# Altium schematic sheet DCDC_RPI.SchDoc
size 420 x 297 mm; SheetNumber: 4; SheetTotal: 4
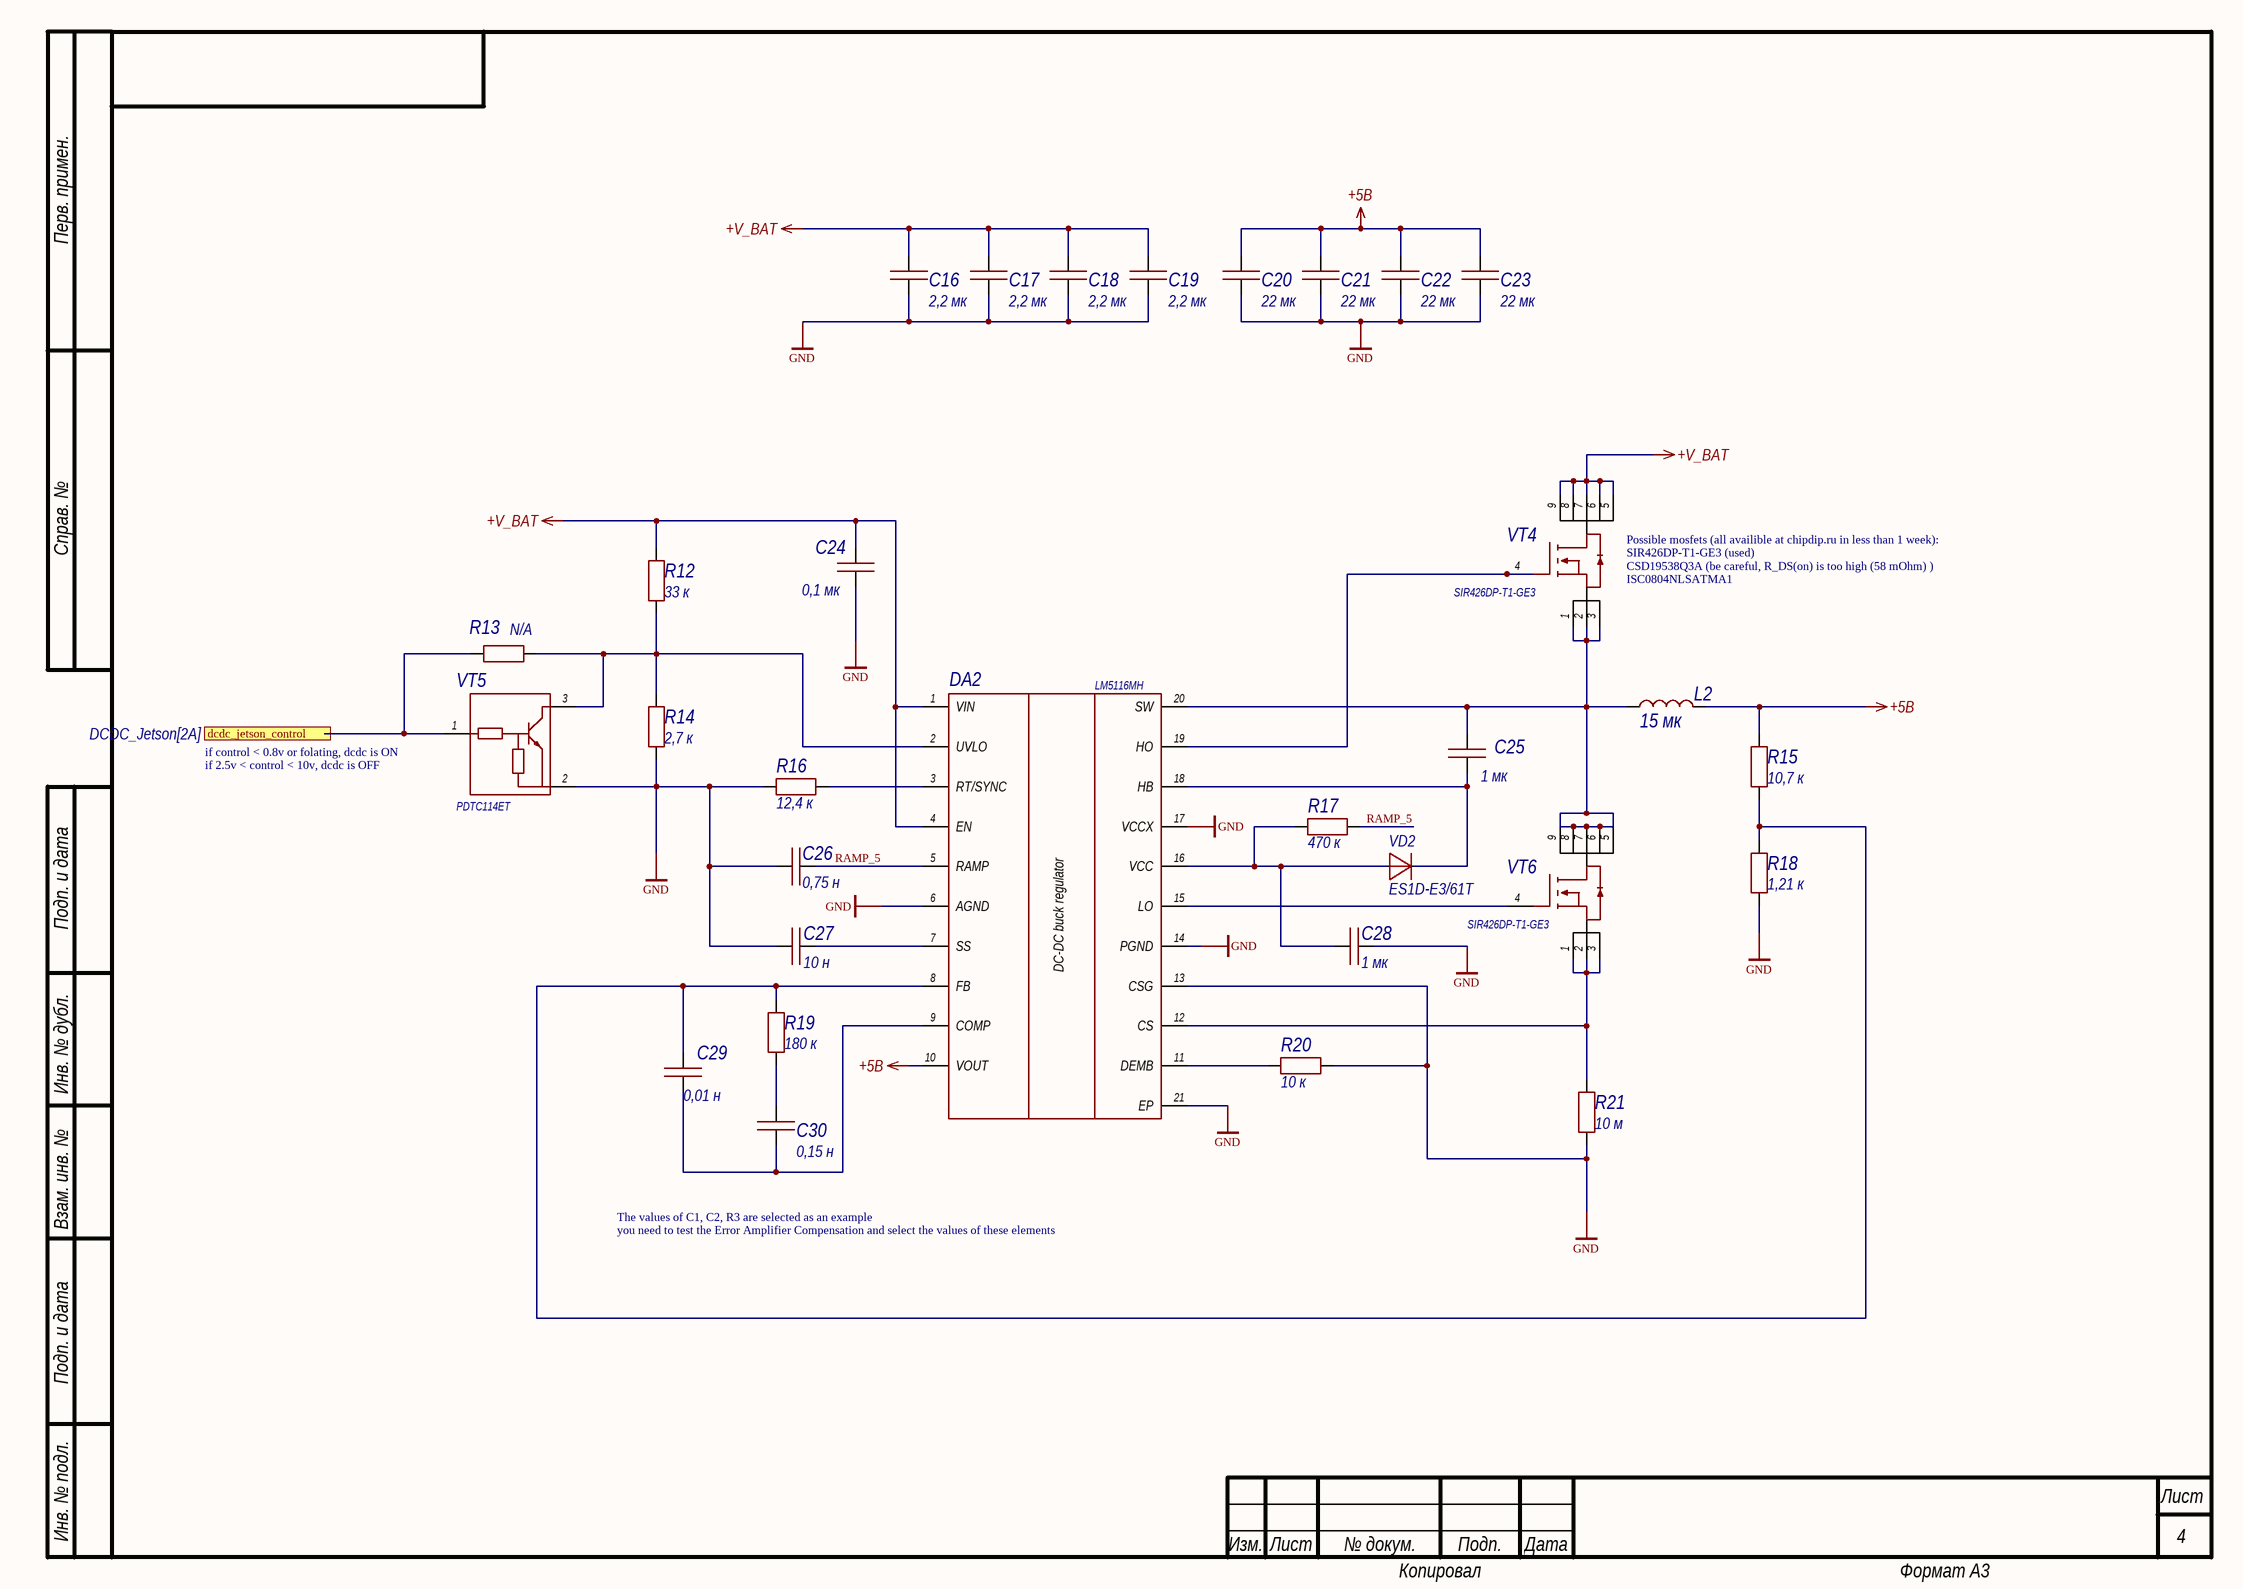
[diagram p0: DCDC_RPI.SchDoc]

## Parts
C16  value 2,2 мк  [1206C]  (hidden comment: Capacitor)
C17  value 2,2 мк  [1206C]  (hidden comment: Capacitor)
C18  value 2,2 мк  [1206C]  (hidden comment: Capacitor)
C19  value 2,2 мк  [1206C]  (hidden comment: Capacitor)
C20  value 22 мк  [1210C]  (hidden comment: Capacitor)
C21  value 22 мк  [1210C]  (hidden comment: Capacitor)
C22  value 22 мк  [1210C]  (hidden comment: Capacitor)
C23  value 22 мк  [1210C]  (hidden comment: Capacitor)
C24  value 0,1 мк  [0603C]  (hidden comment: Capacitor)
C25  value 1 мк  [0603C]  (hidden comment: Capacitor)
C26  value 0,75 н  [0603C]  (hidden comment: Capacitor)
C27  value 10 н  [0603C]  (hidden comment: Capacitor)
C28  value 1 мк  [0603C]  (hidden comment: Capacitor)
C29  value 0,01 н  [0603C]  (hidden comment: Capacitor)
C30  value 0,15 н  [0603C]  (hidden comment: Capacitor)
DA2  LM5116MH  [HTSSOP-20]
L2  value 15 мк  [SPRH127]  (hidden comment: CDSPRH127-150M)
R12  value 33 к  [0603R]  (hidden comment: Resistor)
R13  Resistor  [0603R]  (value not drawn)
R14  value 2,7 к  [0603R]  (hidden comment: Resistor)
R15  value 10,7 к  [0603R]  (hidden comment: Resistor)
R16  value 12,4 к  [0603R]  (hidden comment: Resistor)
R17  value 470 к  [0603R]  (hidden comment: Resistor)
R18  value 1,21 к  [0603R]  (hidden comment: Resistor)
R19  value 180 к  [0603R]  (hidden comment: Resistor)
R20  value 10 к  [0603R]  (hidden comment: Resistor)
R21  value 10 м  [1210R]  (hidden comment: Resistor)
VD2  ES1D-E3/61T  [SMA]
VT4  SIR426DP-T1-GE3  [PowerPAK_SO-8]
VT5  PDTC114ET  [SOT23-3]
VT6  SIR426DP-T1-GE3  [PowerPAK_SO-8]

## Ports
dcdc_jetson_control (in, see DCDC_Jetson[2A])

## Nets
+5В: C20.2 C21.2 C22.2 C23.2 DA2.10(VOUT) L2.2 R15.2
+V_BAT: C16.2 C17.2 C18.2 C19.2 C24.2 DA2.1(VIN) DA2.4(EN) R12.2 VT4.5 VT4.6 VT4.7 VT4.8 VT4.9
GND: C16.1 C17.1 C18.1 C19.1 C20.1 C21.1 C22.1 C23.1 C24.1 C26.1 C27.1 C28.2 DA2.6(AGND) DA2.13(CSG) DA2.14(PGND) DA2.17(VCCX) DA2.21(EP) R14.1 R16.1 R18.1 R20.2 R21.1 VT5.2(E)
dcdc_jetson_control: R13.1 VT5.1(B) ; port dcdc_jetson_control
RAMP_5: C26.2 DA2.5(RAMP) R17.2
NetC25_1: C25.1 DA2.18(HB) VD2.2
NetC25_2: C25.2 DA2.20(SW) L2.1 VT4.1 VT4.2 VT4.3 VT6.5 VT6.6 VT6.7 VT6.8 VT6.9
NetC27_2: C27.2 DA2.7(SS)
NetC28_1: C28.1 DA2.16(VCC) R17.1 VD2.1
NetC29_1: C29.1 C30.1 DA2.9(COMP)
NetC29_2: C29.2 DA2.8(FB) R15.1 R18.2 R19.2
NetC30_2: C30.2 R19.1
NetDA2_2: DA2.2(UVLO) R12.1 R13.2 R14.2 VT5.3(C)
NetDA2_3: DA2.3(RT/SYNC) R16.2
NetDA2_11: DA2.11(DEMB) R20.1
NetDA2_12: DA2.12(CS) R21.2 VT6.1 VT6.2 VT6.3
NetDA2_15: DA2.15(LO) VT6.4
NetDA2_19: DA2.19(HO) VT4.4

## Notes on the sheet
- (near VT4) Possible mosfets (all availible at chipdip.ru in less than 1 week):
- (near VT4) CSD19538Q3A (be careful, R_DS(on) is too high (58 mOhm) )
- (near VT4) SIR426DP-T1-GE3 (used)
- (near VT4) ISC0804NLSATMA1
- (near VT5) if 2.5v < control < 10v, dcdc is OFF
- (near VT5) if control < 0.8v or folating, dcdc is ON
- The values of C1, C2, R3 are selected as an example
- you need to test the Error Amplifier Compensation and select the values of these elements
- Перв. примен.
- Справ. №
- Подп. и дата
- Инв. № дубл.
- Взам. инв. №
- Инв. № подл.
- Изм.
- Лист
- № докум.
- Подп.
- Дата
- Копировал
- Формат А3
- (in symbol LM5116MH) DC-DC buck regulator

## Library data of the parts
C16-C19 = Capacitor_2,2u_10_50V_X7R_1206C: Конденсатор; Library Path2: Schematic\Capacitor.SchLib; Tolerance: 0,1; Voltage (V): 50; Dielectric: X7R; Capacity (nF): 2200; Part Number: Capacitor_2,2u_10_50V_X7R_1206C
C20-C23 = Capacitor_22u_10_25V_X7R_1210C: Конденсатор; Library Path2: Schematic\Capacitor.SchLib; Tolerance: 0,1; Voltage (V): 25; Dielectric: X7R; Capacity (nF): 22000; Part Number: Capacitor_22u_10_25V_X7R_1210C
C24 = Capacitor_0,1u_10_50V_X7R_0603C: Конденсатор; Library Path2: Schematic\Capacitor.SchLib; Tolerance: 0,1; Voltage (V): 50; Dielectric: X7R; Capacity (nF): 100; Part Number: Capacitor_0,1u_10_50V_X7R_0603C
C25 C28 = Capacitor_1u_10_50V_X7R_0603C: Конденсатор; Library Path2: Schematic\Capacitor.SchLib; Tolerance: 0,1; Voltage (V): 50; Dielectric: X7R; Capacity (nF): 1000; Part Number: Capacitor_1u_10_50V_X7R_0603C
C26 = Capacitor_0,75n_10_50V_X7R_0603C: Конденсатор; Library Path2: Schematic\Capacitor.SchLib; Tolerance: 0,1; Voltage (V): 50; Dielectric: X7R; Capacity (nF): 0,75; Part Number: Capacitor_0,75n_10_50V_X7R_0603C
C27 = Capacitor_10n_10_50V_X7R_0603C: Конденсатор; Library Path2: Schematic\Capacitor.SchLib; Tolerance: 0,1; Voltage (V): 50; Dielectric: X7R; Capacity (nF): 10; Part Number: Capacitor_10n_10_50V_X7R_0603C
C29 = Capacitor_0,01n_10_50V_X7R_0603C: Конденсатор; Library Path2: Schematic\Capacitor.SchLib; Tolerance: 0,1; Voltage (V): 50; Dielectric: X7R; Capacity (nF): 0,01; Part Number: Capacitor_0,01n_10_50V_X7R_0603C
C30 = Capacitor_0,15n_10_50V_X7R_0603C: Конденсатор; Library Path2: Schematic\Capacitor.SchLib; Tolerance: 0,1; Voltage (V): 50; Dielectric: X7R; Capacity (nF): 0,15; Part Number: Capacitor_0,15n_10_50V_X7R_0603C
DA2 = LM5116MH: dc-dc понижающий adj 6-100v; Manufacturer_Part_Number: LM5116MH/NOPB; Part Number: LM5116MH
L2 = CDSPRH127-150M: Индуктивность на 15 мкГн, номинальный ток 8,4 А; Inductance (μH): 15; Current (A): 8,4; Part Number: CDSPRH127-150M
R12 = Resistor_33k_1_0603: Резистор номиналом 33 кОм и точностью 1%; Power: *; Part Number: Resistor_33k_1_0603; Tolerance: 1%
R13 = res_0603_N/A: посадочное место 0603 под перемычку; Tolerance: 1%; Power: *; Value: N/A; Part Number: res_0603_N/A
R14 = Resistor_2.7k_1_0603: Резистор номиналом 2,7 кОм и точностью 1%; Power: *; Part Number: Resistor_2.7k_1_0603; Tolerance: 1%
R15 = Resistor_10.7k_1_0603: Резистор номиналом 10,7 кОм и точностью 1%; Power: *; Part Number: Resistor_10.7k_1_0603; Tolerance: 1%
R16 = Resistor_12.4k_1_0603: Резистор номиналом 12,4 кОм и точностью 1%; Power: *; Part Number: Resistor_12.4k_1_0603; Tolerance: 1%
R17 = Resistor_470k_1_0603: Резистор номиналом 470 кОм и точностью 1%; Power: *; Part Number: Resistor_470k_1_0603; Tolerance: 1%
R18 = Resistor_1.21k_1_0603: Резистор номиналом 1,21 кОм и точностью 1%; Power: *; Part Number: Resistor_1.21k_1_0603; Tolerance: 1%
R19 = Resistor_180k_1_0603: Резистор номиналом 180 кОм и точностью 1%; Power: *; Part Number: Resistor_180k_1_0603; Tolerance: 1%
R20 = Resistor_10k_1_0603: Резистор номиналом 10 кОм и точностью 1%; Power: *; Part Number: Resistor_10k_1_0603; Tolerance: 1%
R21 = RL1210FR-070R01L: Резистор номиналом 10 мОм, точностью 1%, 0.5Вт; Power: *; Part Number: RL1210FR-070R01L; Tolerance: 1%
VD2 = ES1D-E3/61T: Диод 1A 200V; Repetitive peak reverse voltage (Vrrm): 200; Current (A): 1; Part Number: ES1D-E3/61T
VT4 VT6 = SIR426DP-T1-GE3: Транзистор полевой MOSFET N-канальный 40В 41.7Вт; Part Number: SIR426DP-T1-GE3; Напряжение С-И/К-Э: 40 В
VT5 = PDTC114ET: цифровой npn 50в 100мА; Ток макс#: 0, 1 А; Part Number: PDTC114ET; Напряжение С-И/К-Э: 50 В